# Altium schematic sheet PR2387_Hardware.SchDoc: Hardware
size 431 x 279 mm; Date: Not shown in title block; ApprovedBy: Not shown in title block; CheckedBy: Not shown in title block; Author: Not shown in title block; CompanyName: Not shown in title block; DrawnBy: M Sunna; Engineer: Not shown in title block; Organization: Not shown in title block; Address1: Not shown in title block; Address2: Not shown in title block; Address3: Not shown in title block; Address4: Not shown in title block; DocumentNumber: 3; Revision: Use project parameter SCH_Rev; SheetNumber: 3; SheetTotal: 3; PageSetup: Record=PageOptions|CenterHorizontal=True|CenterVertical=True|PrintScale=1.00|XCorrection=1.00|YCorrection=1.00|PrintKind=0|BorderSize=5000000|LeftOffset=0|BottomOffset=0|Orientation=2|PaperLength=1000|PaperWidth=1000|Scale=100|PaperSource=15|PrintQuality=600|MediaType=1|DitherType=10|PaperKind=Letter|PrintScaleMode=1; CurrentTime: Not shown in title block; CurrentDate: Not shown in title block; Time: Not shown in title block; DocumentFullPathAndName: Not shown in title block; DocumentName: Not shown in title block; ModifiedDate: Not shown in title block; ImagePath: Not shown in title block
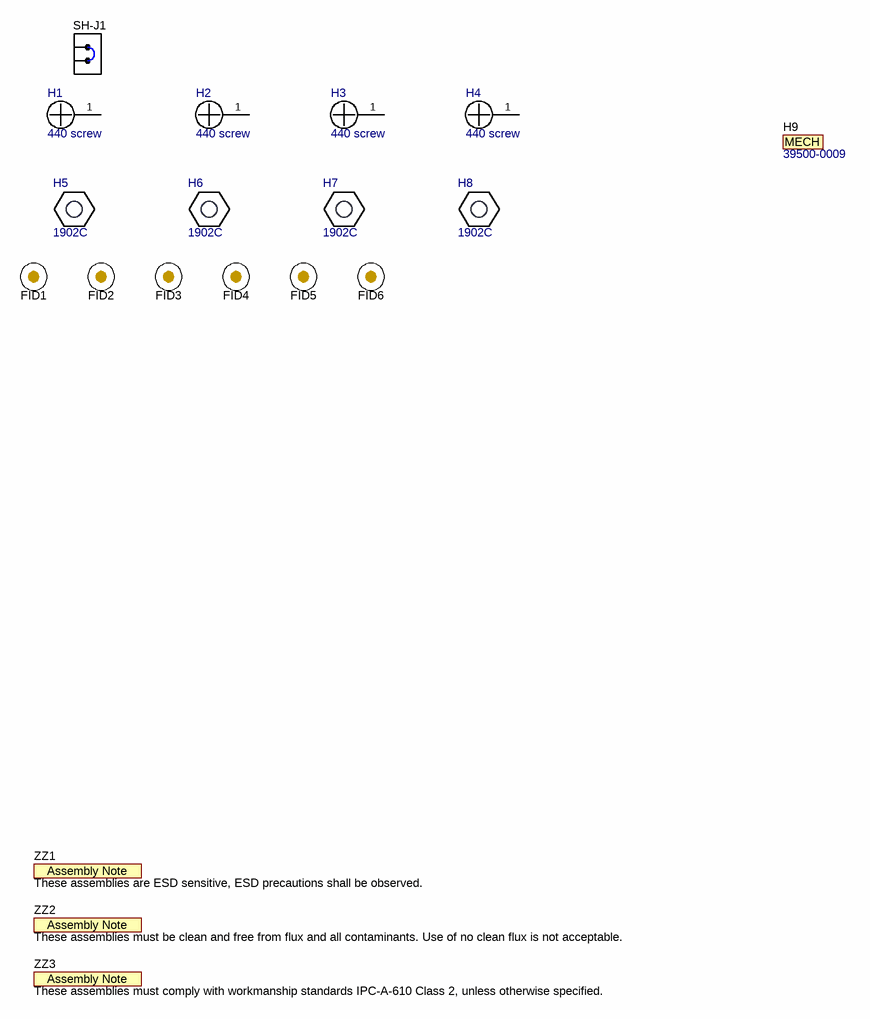
[diagram p0: PR2387_Hardware.SchDoc]

## Parts
FID1  Fiducial  [Fiducial10-20]  (value not drawn)
FID2  Fiducial  [Fiducial10-20]  (value not drawn)
FID3  Fiducial  [Fiducial10-20]  (value not drawn)
FID4  Fiducial  [Fiducial10-20]  (value not drawn)
FID5  Fiducial  [Fiducial10-20]  (value not drawn)
FID6  Fiducial  [Fiducial10-20]  (value not drawn)
H1  440 screw  [NY PMS 440 0025 PH]
H2  440 screw  [NY PMS 440 0025 PH]
H3  440 screw  [NY PMS 440 0025 PH]
H4  440 screw  [NY PMS 440 0025 PH]
H5  1902C  [Keystone_1902C]
H6  1902C  [Keystone_1902C]
H7  1902C  [Keystone_1902C]
H8  1902C  [Keystone_1902C]
H9  39500-0009  (mechanical)
SH-J1  SNT-100-BK-G  [SNT-100-BK-G]  (value not drawn)
ZZ1  These assemblies are ESD sensitive, ESD precautions shall be observed.  [AssemblyNote]  (no BOM)
ZZ2  These assemblies must be clean and free from flux and all contaminants. Use of no clean flux is not acceptable.  [AssemblyNote]  (no BOM)
ZZ3  These assemblies must comply with workmanship standards IPC-A-610 Class 2, unless otherwise specified.  [AssemblyNote]  (no BOM)

## Nets

Not connected (* = marked no-connect by the designer): H1 1; H2 1; H3 1; H4 1

## Notes on the sheet
- (in symbol CMP-0067621-1) MECH

## Library data of the parts
FID1-FID6 = CMP-0077181-1: Fiducial mark.  There is nothing to buy or mount.; CompType: Fiducial; Manufacturer: N/A; MountType: N/A; PackageReference: N/A; PartNumber: N/A; ClassName: FiducialMark; Library Reference: Fiducial
H1-H4 = CMP-0003617-1: Machine Screw, Round, #4-40 x 1/4, Nylon, Philips panhead; Manufacturer: B&F Fastener Supply; CompType: Hardware; ComponentLink1URL: http://www.fasnetdirect.com/refguide/Nylpanms.pdf; Key: NY PMS 440 0025 PH; Publisher: Texas Instruments; Supplier 1: Digi-Key; LatestRevisionDate: 2017-03-09; RoHS: Y; Supplier Part Number 1: H542-ND; MountType: N/A; PartNumber: NY PMS 440 0025 PH; ComponentLink1Description: Datasheet Link; ClassName: Mounting Holes; PackageReference: Screw
H5-H8 = CMP-0003610-1: Standoff, Hex, 0.5"L #4-40 Nylon; Manufacturer: Keystone; CompType: Hardware; ComponentLink1URL: http://www.keyelco.com/pdfs/M55-prod31.pdf; Key: 1902C; Publisher: Texas Instruments; Supplier 1: Digi-Key; PackageReference: Standoff; LatestRevisionDate: 2017-03-09; RoHS: Y; Supplier Part Number 1: 36-1902C-ND; MountType: N/A; PartNumber: 1902C; ComponentLink1Description: Datasheet Link
H9 = CMP-0067621-1: Terminal Block, 9 Pos, 3.5mm; Manufacturer: Molex; CompType: TERM BLOCK; ComponentLink1URL: http://www.molex.com/pdm_docs/sd/395000002_sd.pdf; Key: 39500-0009; Publisher: Texas Instruments; Supplier Part Number 2: 59R2204; Supplier 3: Mouser; Supplier 1: Digi-Key; LatestRevisionDate: 2017-06-05; RoHS: Y; Supplier Part Number 1: WM7739-ND; Supplier Part Number 3: 538-39500-0009; Supplier 2: Newark; MountType: N/A; PartNumber: 39500-0009; ComponentLink1Description: Datasheet Link
SH-J1 = CMP-0003623-3: Shunt, 100mil, Gold plated, Black; Alternate PartNumber: 969102-0000-DA; Manufacturer: Samtec; Alternate Manufacturer: 3M; Value: 1x2; ComponentLink1URL: http://www.samtec.com/ftppub/pdf/SNT.PDF; Supplier 1: Digi-Key; CompType: Shunt; PackageReference: Shunt; ClassName: Shunt; RoHS: Y; Supplier Part Number 1: SAM8858-ND; MountType: N/A; PartNumber: SNT-100-BK-G; ComponentLink1Description: Datasheet Link
ZZ1 = CMP-0077236-1: CompType: AssemblyNote; ClassName: AssemblyNote; Publisher: Texas Instruments; LatestRevisionDate: 2017-08-10; Key: AssemblyNote
ZZ2 = CMP-0077237-1: CompType: AssemblyNote; ClassName: AssemblyNote; Publisher: Texas Instruments; LatestRevisionDate: 2017-08-10; Key: AssemblyNote
ZZ3 = CMP-0077238-1: CompType: AssemblyNote; ClassName: AssemblyNote; Publisher: Texas Instruments; LatestRevisionDate: 2017-08-10; Key: AssemblyNote